# EasyEDA Pro project estop.eprj

# Schematic igvc_2324
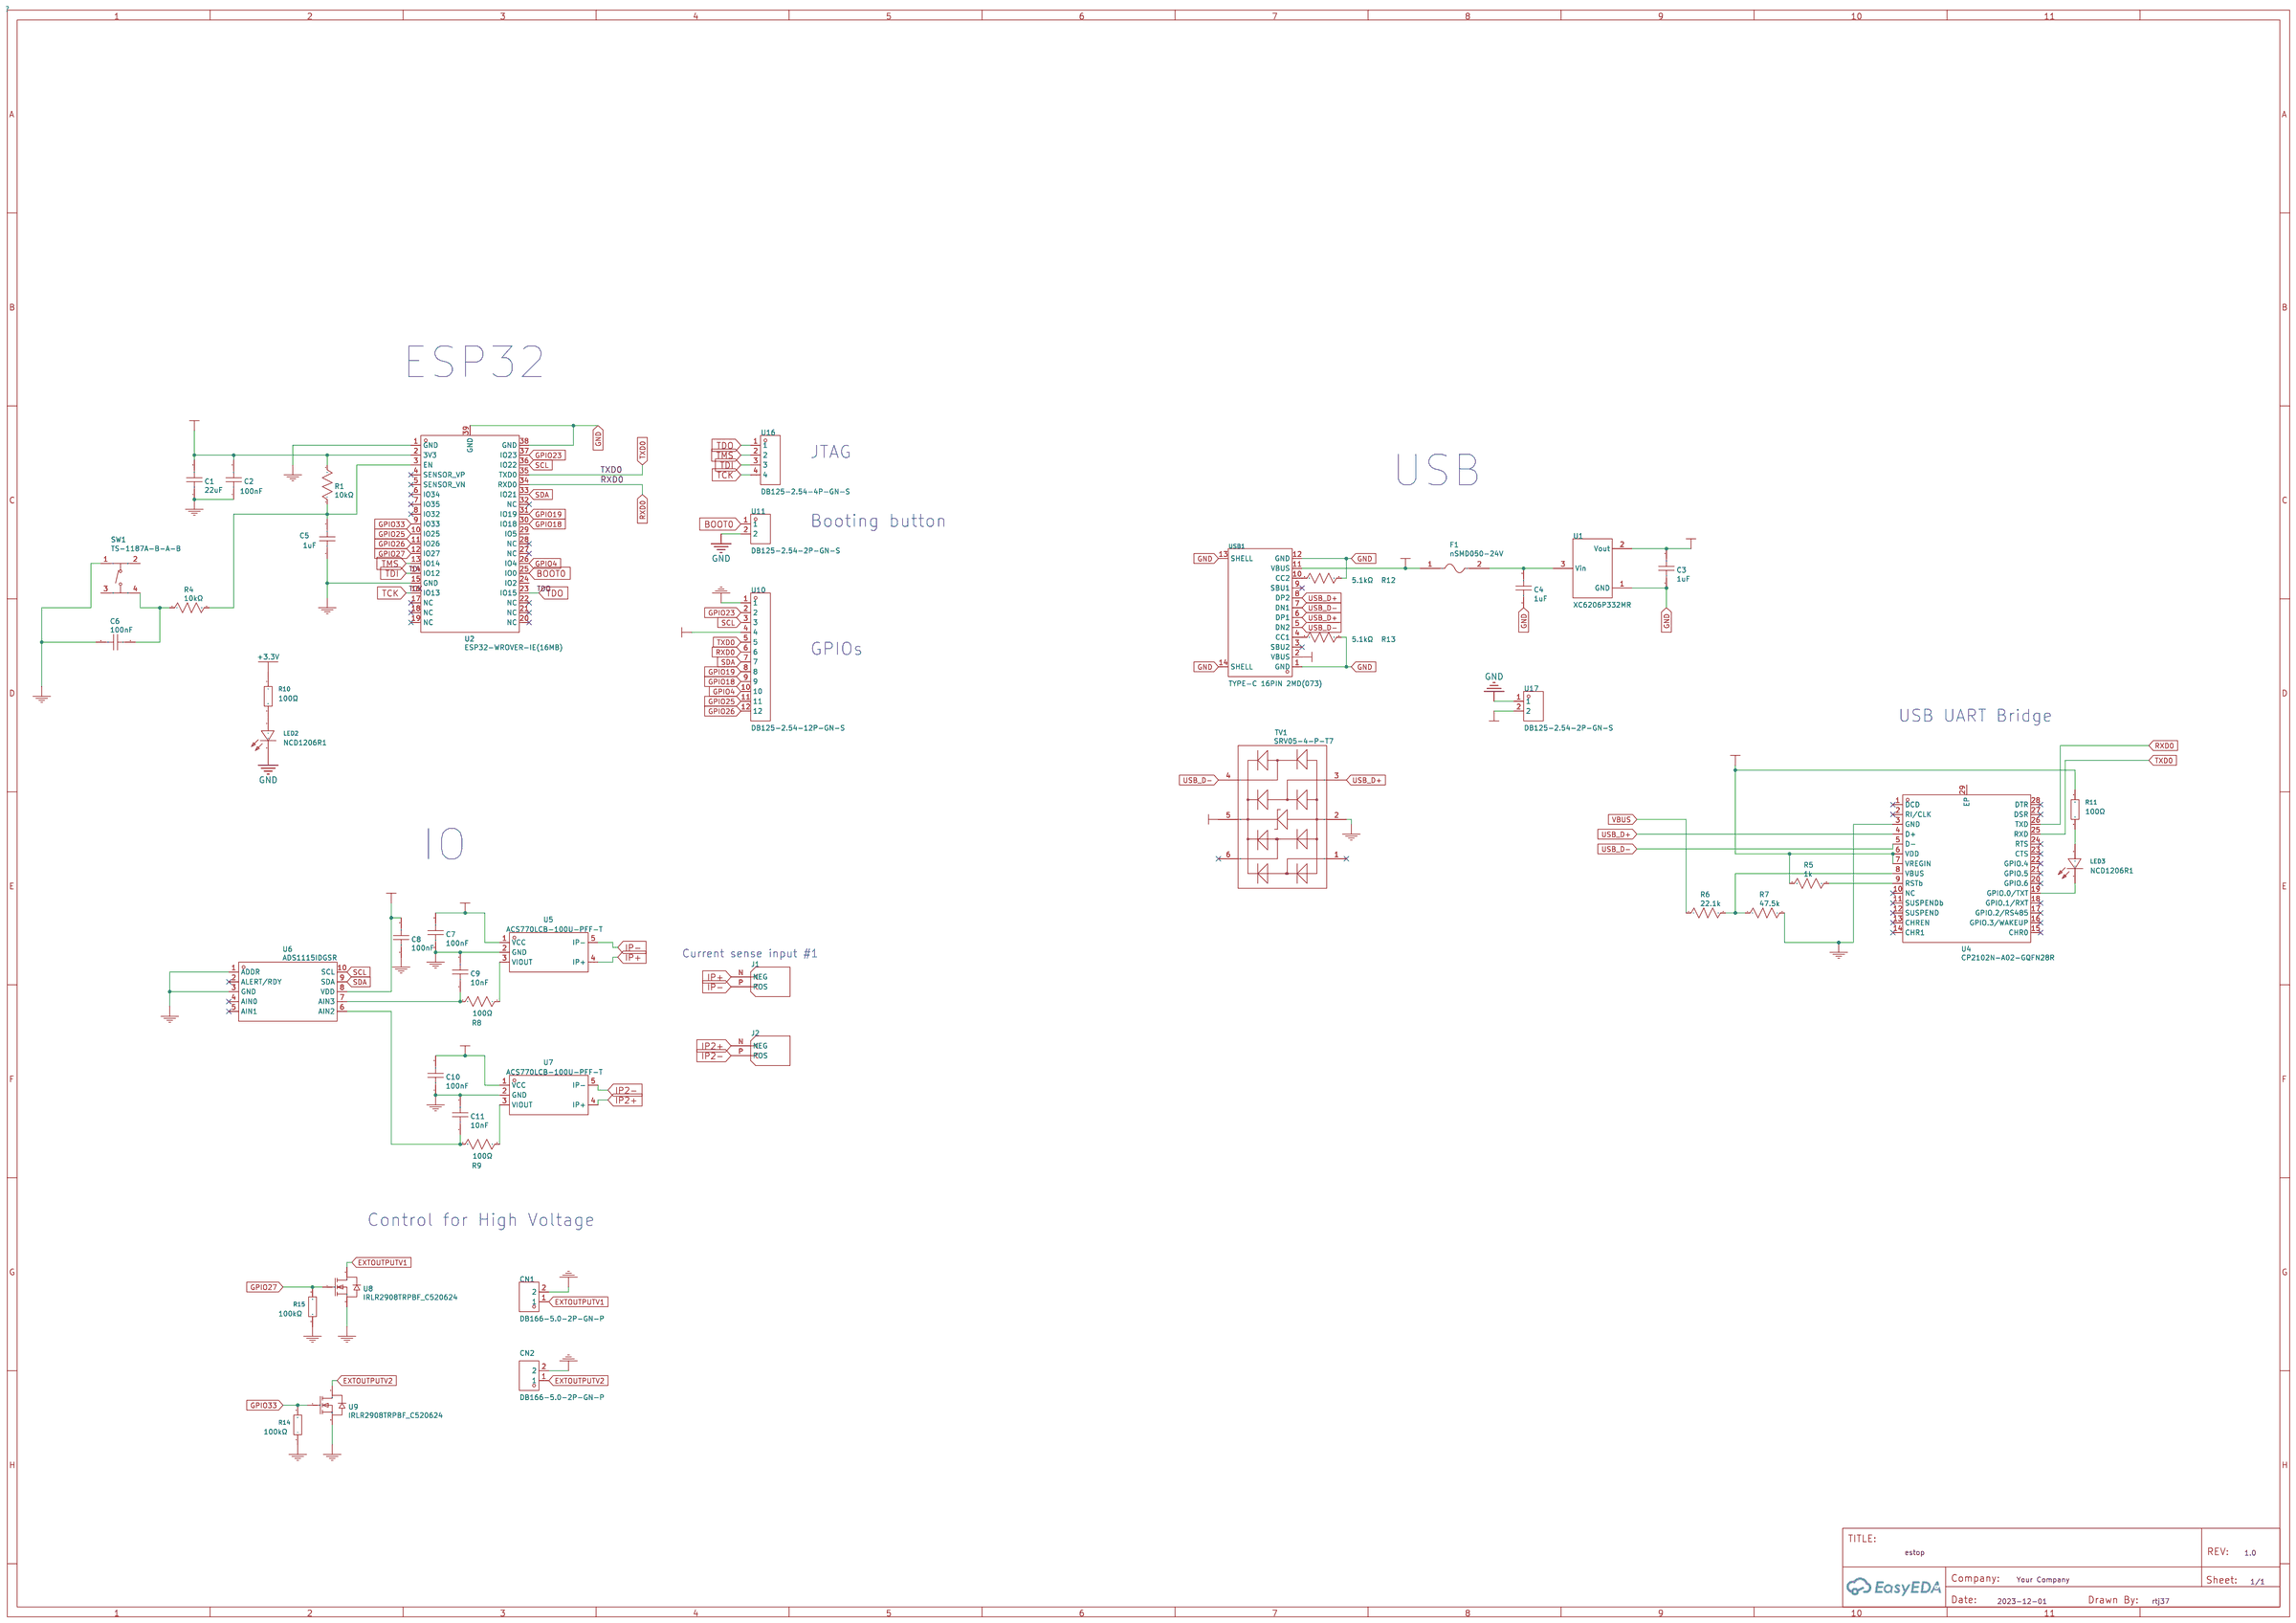
[diagram p0: schematic sheet]

## Parts
C1  22uF  [C1206]
C2  100nF  [C1206]
C3  1uF  [C1206]
C4  1uF  [C1206]
C5  1uF  [C1206]
C6  100nF  [C1206]
C7  100nF  [C1206]
C8  100nF  [C1206]
C9  10nF  [C1206]
C10  100nF  [C1206]
C11  10nF  [C1206]
CN1  DB166-5.0-2P-GN-P  [CONN-TH_2P-P5.00_DB166-5.0-2P-GN-P]
CN2  DB166-5.0-2P-GN-P  [CONN-TH_2P-P5.00_DB166-5.0-2P-GN-P]
F1  nSMD050-24V  [F1206]
J1  XT90PW-F  [AMASS_XT90PW-F]
J2  XT90PW-F  [AMASS_XT90PW-F]
LED2  NCD1206R1  [LED1206-R-RD_RED]
LED3  NCD1206R1  [LED1206-R-RD_RED]
R1  10kΩ  [R1206]
R4  10kΩ  [R1206]
R5  1k  [R1206]
R6  22.1k  [R1206]
R7  47.5k  [R1206]
R8  100Ω  [R1206]
R9  100Ω  [R1206]
R10  100Ω  [R1206]
R11  100Ω  [R1206]
R12  5.1kΩ  [R1206]
R13  5.1kΩ  [R1206]
R14  100kΩ  [R1206]
R15  100kΩ  [R1206]
SW1  TS-1187A-B-A-B  [SW-SMD_4P-L5.1-W5.1-P3.70-LS6.5-TL-2]
TV1  SRV05-4-P-T7  [SOT-23-6_L2.9-W1.6-P0.95-LS2.8-BR]
U1  XC6206P332MR  [SOT-23-3_L2.9-W1.6-P1.90-LS2.8-BR]
U2  ESP32-WROVER-IE(16MB)  [WIFI-SMD_ESP32-WROVER-E]
U4  CP2102N-A02-GQFN28R  [QFN-28_L5.0-W5.0-P0.50-TL-EP3.3]
U5  ACS770LCB-100U-PFF-T  [SENSOR-TH_ACS770LCB-100U-PFF-T]
U6  ADS1115IDGSR  [MSOP-10_L3.0-W3.0-P0.50-LS5.0-BL]
U7  ACS770LCB-100U-PFF-T  [SENSOR-TH_ACS770LCB-100U-PFF-T]
U8  IRLR2908TRPBF_C520624  [TO-252-3_L6.5-W6.1-P4.58-LS9.9-BR]
U9  IRLR2908TRPBF_C520624  [TO-252-3_L6.5-W6.1-P4.58-LS9.9-BR]
U10  DB125-2.54-12P-GN-S  [CONN-TH_DB125-2.54-12P-GN]
U11  DB125-2.54-2P-GN-S  [CONN-TH_DB125-2.54-2P-GN]
U16  DB125-2.54-4P-GN-S  [CONN-TH_DB125-2.54-4P-GN]
U17  DB125-2.54-2P-GN-S  [CONN-TH_DB125-2.54-2P-GN]
USB1  TYPE-C 16PIN 2MD(073)  [USB-C-SMD_TYPE-C-6PIN-2MD-073]

## Library data of the parts
C1 = CL31A226KAHNNNE: Capacitance: Tolerance:±10% Tolerance:±10% Voltage Rated: Temperature Coefficient:; LCSC Part Name: 22uF ±10% 25V; Supplier Part: C12891; Manufacturer: SAMSUNG(三星); Supplier Footprint: 1206; JLCPCB Part Class: Basic Part; Datasheet: https://atta.szlcsc.com/upload/public/pdf/source/20160218/1457707763339.pdf; Supplier: LCSC; Tolerance: ±10%; link: https://item.szlcsc.com/89171.html; 3DModel: C1206_L3.2-W1.6-H1.3
C2 C6 C8 = 1206B104K500NT: Capacitance:100nF Tolerance:±10% Tolerance:±10% Voltage Rated: Temperature Coefficient:; LCSC Part Name: 100nF ±10% 50V; Supplier Part: C110253; Manufacturer: FH(风华); Supplier Footprint: 1206; JLCPCB Part Class: Extended Part; Datasheet: https://atta.szlcsc.com/upload/public/pdf/source/20200305/C486355_26A10D38EF8C2A5C37091D0039909270.pdf; Supplier: LCSC; Tolerance: ±10%; link: https://item.szlcsc.com/89171.html; 3DModel: C1206_L3.2-W1.6-H1.3
C3 C4 = 1206B105K500NT_C90539: Capacitance:1uF Tolerance:±10% Tolerance:±10% Voltage Rated: Temperature Coefficient:; LCSC Part Name: 1uF ±10% 50V; Supplier Part: C90539; Manufacturer: FH(风华); Manufacturer Part: 1206B105K500NT; Supplier Footprint: 1206; JLCPCB Part Class: Extended Part; Datasheet: https://atta.szlcsc.com/upload/public/pdf/source/20200305/C486355_26A10D38EF8C2A5C37091D0039909270.pdf; Supplier: LCSC; Tolerance: ±10%; link: https://item.szlcsc.com/362304.html; 3DModel: C0603_L1.6-W0.8-H0.8
C5 = 1206B105K500NT_C90539: Capacitance:1uF Tolerance:±10% Tolerance:±10% Voltage Rated: Temperature Coefficient:; LCSC Part Name: 1uF ±10% 50V; Supplier Part: C90539; Manufacturer: FH(风华); Manufacturer Part: 1206B105K500NT; Supplier Footprint: 1206; JLCPCB Part Class: Extended Part; Datasheet: https://atta.szlcsc.com/upload/public/pdf/source/20200305/C486355_26A10D38EF8C2A5C37091D0039909270.pdf; Supplier: LCSC; Tolerance: ±10%; link: https://item.szlcsc.com/89171.html; 3DModel: C1206_L3.2-W1.6-H1.3
C7 C10 = 1206B104K500NT: Capacitance:100nF Tolerance:±10% Tolerance:±10% Voltage Rated: Temperature Coefficient:; LCSC Part Name: 100nF ±10% 50V; Supplier Part: C110253; Manufacturer: FH(风华); Supplier Footprint: 1206; JLCPCB Part Class: Extended Part; Datasheet: https://atta.szlcsc.com/upload/public/pdf/source/20200305/C486355_26A10D38EF8C2A5C37091D0039909270.pdf; Supplier: LCSC; Tolerance: ±10%; link: https://item.szlcsc.com/373011.html; 3DModel: C0805_L2.0-W1.3-H1.3
C9 C11 = 1206B103K102CT_C77498: Capacitance: Tolerance:±10% Tolerance:±10% Voltage Rated: Temperature Coefficient:; LCSC Part Name: 10nF ±10% 1kV; Supplier Part: C77498; Manufacturer: Walsin(华新科); Manufacturer Part: 1206B103K102CT; Supplier Footprint: 1206; JLCPCB Part Class: Extended Part; Supplier: LCSC; Tolerance: ±10%; link: https://item.szlcsc.com/373011.html; 3DModel: C0805_L2.0-W1.3-H1.3
CN1 CN2 = DB166-5.0-2P-GN-P: Pitch:5mm Number of Pins:2P; LCSC Part Name: 5mm; Supplier Part: C5162335; Manufacturer: DORABO(地博电气); Supplier Footprint: P=5mm; JLCPCB Part Class: Extended Part; Datasheet: https://atta.szlcsc.com/upload/public/pdf/source/20230321/B3942604DCE96DBD4C39B644F5671C5C.pdf; Supplier: LCSC; Pitch: 5mm; Number of Pins: 2P
F1 = nSMD050-24V: 3DModel: F1206_L3.2-W1.7-H0.6; link: https://lcsc.com/eda_search?q=C70076&amp;%26type=1&amp;ref=editor; Supplier: LCSC; Manufacturer: 台湾陆海; Supplier Part: C70076; JLCPCB Part Class: Extended Part
J1 J2 = XT90PW-F: \nSocket, DC supply, XT90, female, PIN:2, on PCBs, THT\n; MF: AMASS; MAXIMUM_PACKAGE_HEIGHT: 10.3 mm; Price: None; Check_prices: https://www.snapeda.com/parts/XT90PW-F/AMASS/view-part/?ref=eda; STANDARD: Manufacturer Recommendations; PARTREV: V00; SnapEDA_Link: https://www.snapeda.com/parts/XT90PW-F/AMASS/view-part/?ref=snap; Availability: Not in stock; MANUFACTURER: AMASS
LED2 LED3 = NCD1206R1_C84270: Emitted Color:Red Forward Voltage (VF):1.6V~2.6V Forward Voltage (VF):1.6V~2.6V Power Dissipation:65mW Forward Current:20mA Dominant Wavelength:615nm~630nm Dominant Wavelength:615nm~630nm Lens Color:无色透明透镜 Luminous Intensity:67mcd~195mcd Luminous Intensit; Supplier Part: C84270; Manufacturer: 国星光电; Supplier Footprint: 1206; JLCPCB Part Class: Extended Part; Datasheet: https://atta.szlcsc.com/upload/public/pdf/source/20200820/C84270_26D056BA53480CD9796A84C2EB45318C.pdf; Supplier: LCSC; Emitted Color: Red; Forward Voltage (VF): 1.6V~2.6V; Power Dissipation: 65mW; Forward Current: 20mA; Dominant Wavelength: 615nm~630nm; Lens Color: 无色透明透镜; Luminous Intensity: 67mcd~195mcd; Viewing Angle: 130°; Operating Temperature: -30℃~+85℃
R1 R4 = 1206W4F1002T5E: Type:Thick Film Resistors Resistance:10kΩ Tolerance:±1% Tolerance:±1% Power(Watts): Overload Voltage (Max): Temperature Coefficient:±100ppm/℃ Temperature Coefficient:±100ppm/℃ Operating Temperature Range:-55℃~+155℃ Operating Temperature Range:-55℃~+155℃; LCSC Part Name: 10kΩ ±1% 250mW 厚膜电阻; Supplier Part: C17902; Manufacturer: UNI-ROYAL(厚声); Supplier Footprint: 1206; JLCPCB Part Class: Basic Part; Datasheet: https://atta.szlcsc.com/upload/public/pdf/source/20200306/C422600_1E6D84923E4A46A82E41ADD87F860B5C.pdf; Supplier: LCSC; Type: Thick Film Resistors; Tolerance: ±1%; Temperature Coefficient: ±100ppm/℃; Operating Temperature Range: -55℃~+155℃; link: https://item.szlcsc.com/311874.html; 3DModel: R1206_L3.2-W1.6-H0.6
R5 = 1k: link: https://item.szlcsc.com/311874.html; 3DModel: R1206_L3.2-W1.6-H0.6; Supplier Part: C144508; Supplier: JLCPCB
R6 = 22.1k: link: https://item.szlcsc.com/311874.html; 3DModel: R1206_L3.2-W1.6-H0.6; Supplier Part: C2933645; Supplier: JLCPCB
R7 = 47.5k: link: https://item.szlcsc.com/311874.html; 3DModel: R1206_L3.2-W1.6-H0.6; Supplier Part: C3017055; Supplier: JLCPCB
R8 R9 = 1206W4F1000T5E_C17901: Type:Thick Film Resistors Resistance: Tolerance:±1% Tolerance:±1% Power(Watts): Overload Voltage (Max): Temperature Coefficient:±100ppm/℃ Temperature Coefficient:±100ppm/℃ Operating Temperature Range:-55℃~+155℃ Operating Temperature Range:-55℃~+155℃; LCSC Part Name: 100Ω ±1% 250mW 厚膜电阻; Supplier Part: C17901; Manufacturer: UNI-ROYAL(厚声); Manufacturer Part: 1206W4F1000T5E; Supplier Footprint: 1206; JLCPCB Part Class: Basic Part; Datasheet: https://atta.szlcsc.com/upload/public/pdf/source/20200306/C422600_1E6D84923E4A46A82E41ADD87F860B5C.pdf; Supplier: LCSC; Type: Thick Film Resistors; Tolerance: ±1%; Temperature Coefficient: ±100ppm/℃; Operating Temperature Range: -55℃~+155℃; 3DModel: R0603; link: https://www.mouser.in/datasheet/2/447/PYu_RT_1_to_0_01_RoHS_L_11-1669912.pdf
R10 R11 = 1206W4F1000T5E_C17901: Type:Thick Film Resistors Resistance: Tolerance:±1% Tolerance:±1% Power(Watts): Overload Voltage (Max): Temperature Coefficient:±100ppm/℃ Temperature Coefficient:±100ppm/℃ Operating Temperature Range:-55℃~+155℃ Operating Temperature Range:-55℃~+155℃; LCSC Part Name: 100Ω ±1% 250mW 厚膜电阻; Supplier Part: C17901; Manufacturer: UNI-ROYAL(厚声); Manufacturer Part: 1206W4F1000T5E; Supplier Footprint: 1206; JLCPCB Part Class: Basic Part; Datasheet: https://atta.szlcsc.com/upload/public/pdf/source/20200306/C422600_1E6D84923E4A46A82E41ADD87F860B5C.pdf; Supplier: LCSC; Type: Thick Film Resistors; Tolerance: ±1%; Temperature Coefficient: ±100ppm/℃; Operating Temperature Range: -55℃~+155℃
R12 R13 = 1206W4F5101T5E: Type:Thick Film Resistors Resistance:5.1kΩ Tolerance:±1% Tolerance:±1% Power(Watts): Overload Voltage (Max): Temperature Coefficient:±100ppm/℃ Temperature Coefficient:±100ppm/℃ Operating Temperature Range:-55℃~+155℃ Operating Temperature Range:-55℃~+155℃; LCSC Part Name: 5.1kΩ ±1% 250mW 厚膜电阻; Supplier Part: C26033; Manufacturer: UNI-ROYAL(厚声); Supplier Footprint: 1206; JLCPCB Part Class: Extended Part; Datasheet: https://atta.szlcsc.com/upload/public/pdf/source/20200306/C422600_1E6D84923E4A46A82E41ADD87F860B5C.pdf; Supplier: LCSC; Type: Thick Film Resistors; Tolerance: ±1%; Temperature Coefficient: ±100ppm/℃; Operating Temperature Range: -55℃~+155℃; 3DModel: R0603; link: https://www.mouser.in/datasheet/2/447/PYu_RT_1_to_0_01_RoHS_L_11-1669912.pdf
R14 R15 = 1206W4F1003T5E: Type:Thick Film Resistors Resistance:100kΩ Tolerance:±1% Tolerance:±1% Power(Watts): Overload Voltage (Max): Temperature Coefficient:±100ppm/℃ Temperature Coefficient:±100ppm/℃ Operating Temperature Range:-55℃~+155℃ Operating Temperature Range:-55℃~+155℃; LCSC Part Name: 100kΩ ±1% 250mW 厚膜电阻; Supplier Part: C17900; Manufacturer: UNI-ROYAL(厚声); Supplier Footprint: 1206; JLCPCB Part Class: Basic Part; Datasheet: https://atta.szlcsc.com/upload/public/pdf/source/20200306/C422600_1E6D84923E4A46A82E41ADD87F860B5C.pdf; Supplier: LCSC; Type: Thick Film Resistors; Tolerance: ±1%; Temperature Coefficient: ±100ppm/℃; Operating Temperature Range: -55℃~+155℃
SW1 = TS-1187A-B-A-B: link: https://lcsc.com/eda_search?q=C318884&amp;%26type=1&amp;ref=editor; 3DModel: SW-SMD_4P-L5.2-W5.2-H1.5-LS6.4-P3.70; Supplier: LCSC; Supplier Part: C318884; Manufacturer: XKB Connectivity(中国星坤); JLCPCB Part Class: Basic Part
TV1 = SRV05-4-P-T7: link: https://lcsc.com/eda_search?q=C85364&amp;%26type=1&amp;ref=editor; 3DModel: SOT-23-6_L2.9-W1.6-H1.5-LS2.8-P0.95; Supplier: LCSC; Manufacturer: PROTEK; Supplier Part: C85364; JLCPCB Part Class: Basic Part
U1 = XC6206P332MR: link: https://lcsc.com/eda_search?q=C5446&amp;%26type=1&amp;ref=editor; 3DModel: SOT-23-3L_L2.9-W1.6-H1.1-LS2.8-P0.95; Supplier: LCSC; Manufacturer: TOREX(特瑞仕); Supplier Part: C5446; JLCPCB Part Class: Basic Part
U2 = ESP32-WROVER-IE(16MB): link: https://lcsc.com/eda_search?q=C701352&amp;%26type=1&amp;ref=editor; 3DModel: WIFI-SMD_L31.4-W18.0-H3.3-ESP32-WROVER-E; Supplier: LCSC; Supplier Part: C701352; Manufacturer: ESPRESSIF(乐鑫); Manufacturer Part: ESP32-WROVER-IE-N16R8; JLCPCB Part Class: Extended Part
U4 = CP2102N-A02-GQFN28R: link: https://lcsc.com/eda_search?q=C964632&amp;%26type=1&amp;ref=editor; 3DModel: QFN-28_L5.0-W5.0-H0.9-P0.50; Supplier: LCSC; Supplier Part: C964632; Manufacturer: SILICON LABS(芯科); JLCPCB Part Class: Extended Part
U5 U7 = ACS770LCB-100U-PFF-T: link: https://lcsc.com/eda_search?q=C163295&amp;%26type=1&amp;ref=editor; 3DModel: SENSOR-TH_L10.0-W13.0-H7.0-ACS770LCB-100U-PFF-T; Supplier: LCSC; Manufacturer: ALLEGRO(美国埃戈罗); Supplier Part: C163295; JLCPCB Part Class: Extended Part
U6 = ADS1115IDGSR: link: https://lcsc.com/eda_search?q=C37593&amp;%26type=1&amp;ref=editor; 3DModel: MSOP-10_L3.0-W3.0-H1.1-LS5.0-P0.50; Supplier: LCSC; Manufacturer: TI(德州仪器); Supplier Part: C37593; JLCPCB Part Class: Extended Part
U8 U9 = IRLR2908TRPBF_C520624: link: https://lcsc.com/eda_search?q=C520624&amp;%26type=1&amp;ref=editor; Supplier: LCSC; Supplier Part: C520624; Manufacturer: Infineon(英飞凌); Manufacturer Part: IRLR2908TRPBF; JLCPCB Part Class: Extended Part
U10 = DB125-2.54-12P-GN-S: Structure:1x12P Pitch:2.54mm Color:Green Mounting Style:Straight Current Rating (Max):8A Voltage Rating (Max):130V Number of Pins:12P Number of Rows:1 Wire Gauge - AWG:18~26 Wire Gauge - AWG:18~26 Wire Gauge - mm2:0.5~1 Wire Gauge - mm2:0.5~1 Number of PI; LCSC Part Name: 2.54mm 1x12P 排数:1 每排P数:12 直插; Supplier Part: C918129; Manufacturer: DORABO(地博电气); Supplier Footprint: 插件,P=2.54mm; JLCPCB Part Class: Extended Part; Datasheet: https://atta.szlcsc.com/upload/public/pdf/source/20230106/BCD3A0BE1EB95DC3E813F1745F022035.pdf; Supplier: LCSC; Structure: 1x12P; Pitch: 2.54mm; Color: Green; Mounting Style: Straight; Current Rating (Max): 8A; Voltage Rating (Max): 130V; Number of Pins: 12P; Number of Rows: 1; Wire Gauge - AWG: 18~26; Wire Gauge - mm2: 0.5~1; Number of PINs Per Row: 12; Operating Temperature Range: -40℃~+105℃
U11 U17 = DB125-2.54-2P-GN-S: Structure:1x2P Pitch:2.54mm Color:Green Mounting Style:Straight Current Rating (Max):8A Voltage Rating (Max):130V Number of Pins:2P Number of Rows:1 Wire Gauge - AWG:18~26 Wire Gauge - AWG:18~26 Wire Gauge - mm2:0.5~1 Wire Gauge - mm2:0.5~1 Number of PINs; LCSC Part Name: 2.54mm 1x2P 排数:1 每排P数:2 直插; Supplier Part: C918120; Manufacturer: DORABO(地博电气); Supplier Footprint: 插件,P=2.54mm; JLCPCB Part Class: Extended Part; Datasheet: https://atta.szlcsc.com/upload/public/pdf/source/20230106/BCD3A0BE1EB95DC3E813F1745F022035.pdf; Supplier: LCSC; Structure: 1x2P; Pitch: 2.54mm; Color: Green; Mounting Style: Straight; Current Rating (Max): 8A; Voltage Rating (Max): 130V; Number of Pins: 2P; Number of Rows: 1; Wire Gauge - AWG: 18~26; Wire Gauge - mm2: 0.5~1; Number of PINs Per Row: 2; Operating Temperature Range: -40℃~+105℃
U16 = DB125-2.54-4P-GN-S: Structure:1x4P Pitch:2.54mm Color:Green Mounting Style:Straight Current Rating (Max):8A Voltage Rating (Max):130V Number of Pins:4P Number of Rows:1 Wire Gauge - AWG:18~26 Wire Gauge - AWG:18~26 Wire Gauge - mm2:0.5~1 Wire Gauge - mm2:0.5~1 Number of PINs; LCSC Part Name: 2.54mm 1x4P 排数:1 每排P数:4 直插; Supplier Part: C918122; Manufacturer: DORABO(地博电气); Supplier Footprint: 插件,P=2.54mm; JLCPCB Part Class: Extended Part; Datasheet: https://atta.szlcsc.com/upload/public/pdf/source/20230106/BCD3A0BE1EB95DC3E813F1745F022035.pdf; Supplier: LCSC; Structure: 1x4P; Pitch: 2.54mm; Color: Green; Mounting Style: Straight; Current Rating (Max): 8A; Voltage Rating (Max): 130V; Number of Pins: 4P; Number of Rows: 1; Wire Gauge - AWG: 18~26; Wire Gauge - mm2: 0.5~1; Number of PINs Per Row: 4; Operating Temperature Range: -40℃~+105℃
USB1 = TYPE-C 16PIN 2MD(073): Connector Type:Type-C Standard:- Gender:Female Number of Ports:1 Number of Contacts:16P Mounting Style:卧贴 Current Rating - Power (Max):5A Operating Temperature Range:-25℃~+85℃ Operating Temperature Range:-25℃~+85℃; LCSC Part Name: Type-C 母 卧贴; Supplier Part: C2765186; Manufacturer: SHOU HAN(首韩); Supplier Footprint: SMD; JLCPCB Part Class: Extended Part; Datasheet: https://atta.szlcsc.com/upload/public/pdf/source/20211123/39B17C16241EAC15C5E277BDA434118E.pdf; Supplier: LCSC; Connector Type: Type-C; Gender: Female; Number of Ports: 1; Number of Contacts: 16P; Mounting Style: 卧贴; Current Rating - Power (Max): 5A; Operating Temperature Range: -25℃~+85℃

## Nets
+3.3V: C1.2 C2.2 C3.2 C8.2 R1.2 R5.1 R10.1 R11.1 U1.2(Vout) U2.2(3V3) U4.6(VDD) U4.7(VREGIN) U6.8(VDD) U10.4
GND: C1.1 C2.1 C3.1 C4.1 C5.1 C6.1 C7.1 C8.1 C9.2 C10.1 C11.2 CN1.2 CN2.2 LED2.2(K) R7.2 R12.2 R13.2 R14.1 R15.1 SW1.1(A) TV1.2 U1.1(GND) U2.1(GND) U2.15(GND) U2.38(GND) U2.39(GND) U4.3(GND) U5.2(GND) U6.1(ADDR) U6.3(GND) U7.2(GND) U8.3(S) U9.3(S) U10.1 U11.2 U17.1 USB1.1(GND) USB1.12(GND) USB1.13(SHELL) USB1.14(SHELL)
VBUS: C7.2 C10.2 F1.1 R6.1 TV1.5 U5.1(VCC) U7.1(VCC) U17.2 USB1.2(VBUS) USB1.11(VBUS)
BOOT0: U2.25(IO0) U11.1
EXTOUTPUTV1: CN1.1 U8.2(D)
EXTOUTPUTV2: CN2.1 U9.2(D)
GPIO4: U2.26(IO4) U10.10
GPIO18: U2.30(IO18) U10.9
GPIO19: U2.31(IO19) U10.8
GPIO23: U2.37(IO23) U10.2
GPIO25: U2.10(IO25) U10.11
GPIO26: U2.11(IO26) U10.12
GPIO27: R15.2 U2.12(IO27) U8.1(G)
GPIO33: R14.2 U2.9(IO33) U9.1(G)
IP2+: J2.N(NEG) U7.4(IP+)
IP2-: J2.P(POS) U7.5(IP-)
IP+: J1.N(NEG) U5.4(IP+)
IP-: J1.P(POS) U5.5(IP-)
RXD0: U2.34(RXD0) U4.26(TXD) U10.6
SCL: U2.36(IO22) U6.10(SCL) U10.3
SDA: U2.33(IO21) U6.9(SDA) U10.7
TCK: U2.16(IO13) U16.4
TDI: U2.14(IO12) U16.3
TDO: U2.23(IO15) U16.1
TMS: U2.13(IO14) U16.2
TXD0: U2.35(TXD0) U4.25(RXD) U10.5
USB_D+: TV1.3 U4.4(D+) USB1.6(DP1) USB1.8(DP2)
USB_D-: TV1.4 U4.5(D-) USB1.5(DN2) USB1.7(DN1)
$1N2: C6.2 R4.1 SW1.4(D)
$1N3: C5.2 R1.1 R4.2 U2.3(EN)
$1N21: C4.2 F1.2 U1.3(Vin)
$1N27: LED3.1(A) R11.2
$1N28: LED3.2(K) U4.19(GPIO.0/TXT)
$1N32: R6.2 R7.1 U4.8(VBUS)
$1N37: R5.2 U4.9(RSTb)
$1N45: C11.1 R9.2 U6.6(AIN2)
$1N46: R9.1 U7.3(VIOUT)
$1N48: C9.1 R8.2 U6.7(AIN3)
$1N49: R8.1 U5.3(VIOUT)
$1N11253: LED2.1(A) R10.2
$1N11937: R12.1 USB1.10(CC2)
$1N11979: R13.1 USB1.4(CC1)

Not connected (* = marked no-connect by the designer): SW1 2(B) 3(C); TV1 1* 6*; U2 4(SENSOR_VP)* 5(SENSOR_VN)* 6(IO34)* 7(IO35)* 8(IO32)* 17(NC)* 18(NC)* 19(NC)* 20(NC)* 21(NC)* 22(NC)* 24(IO2) 27(NC)* 28(NC)* 29(IO5) 32(NC)*; U4 1(DCD)* 2(RI/CLK)* 10(NC)* 11(SUSPENDb)* 12(SUSPEND)* 13(CHREN)* 14(CHR1)* 15(CHR0)* 16(GPIO.3/WAKEUP)* 17(GPIO.2/RS485)* 18(GPIO.1/RXT)* 20(GPIO.6)* 21(GPIO.5)* 22(GPIO.4)* 23(CTS)* 24(RTS)* 27(DSR)* 28(DTR)* 29(EP); U6 2(ALERT/RDY)* 4(AIN0)* 5(AIN1)*; USB1 3(SBU2)* 9(SBU1)*

## Notes on the sheet
- ESP32
- JTAG
- USB
- Booting button
- GPIOs
- USB UART Bridge
- IO
- Current sense input #1
- Control for High Voltage

# Board 1-PCB_PCB_igvc_2324
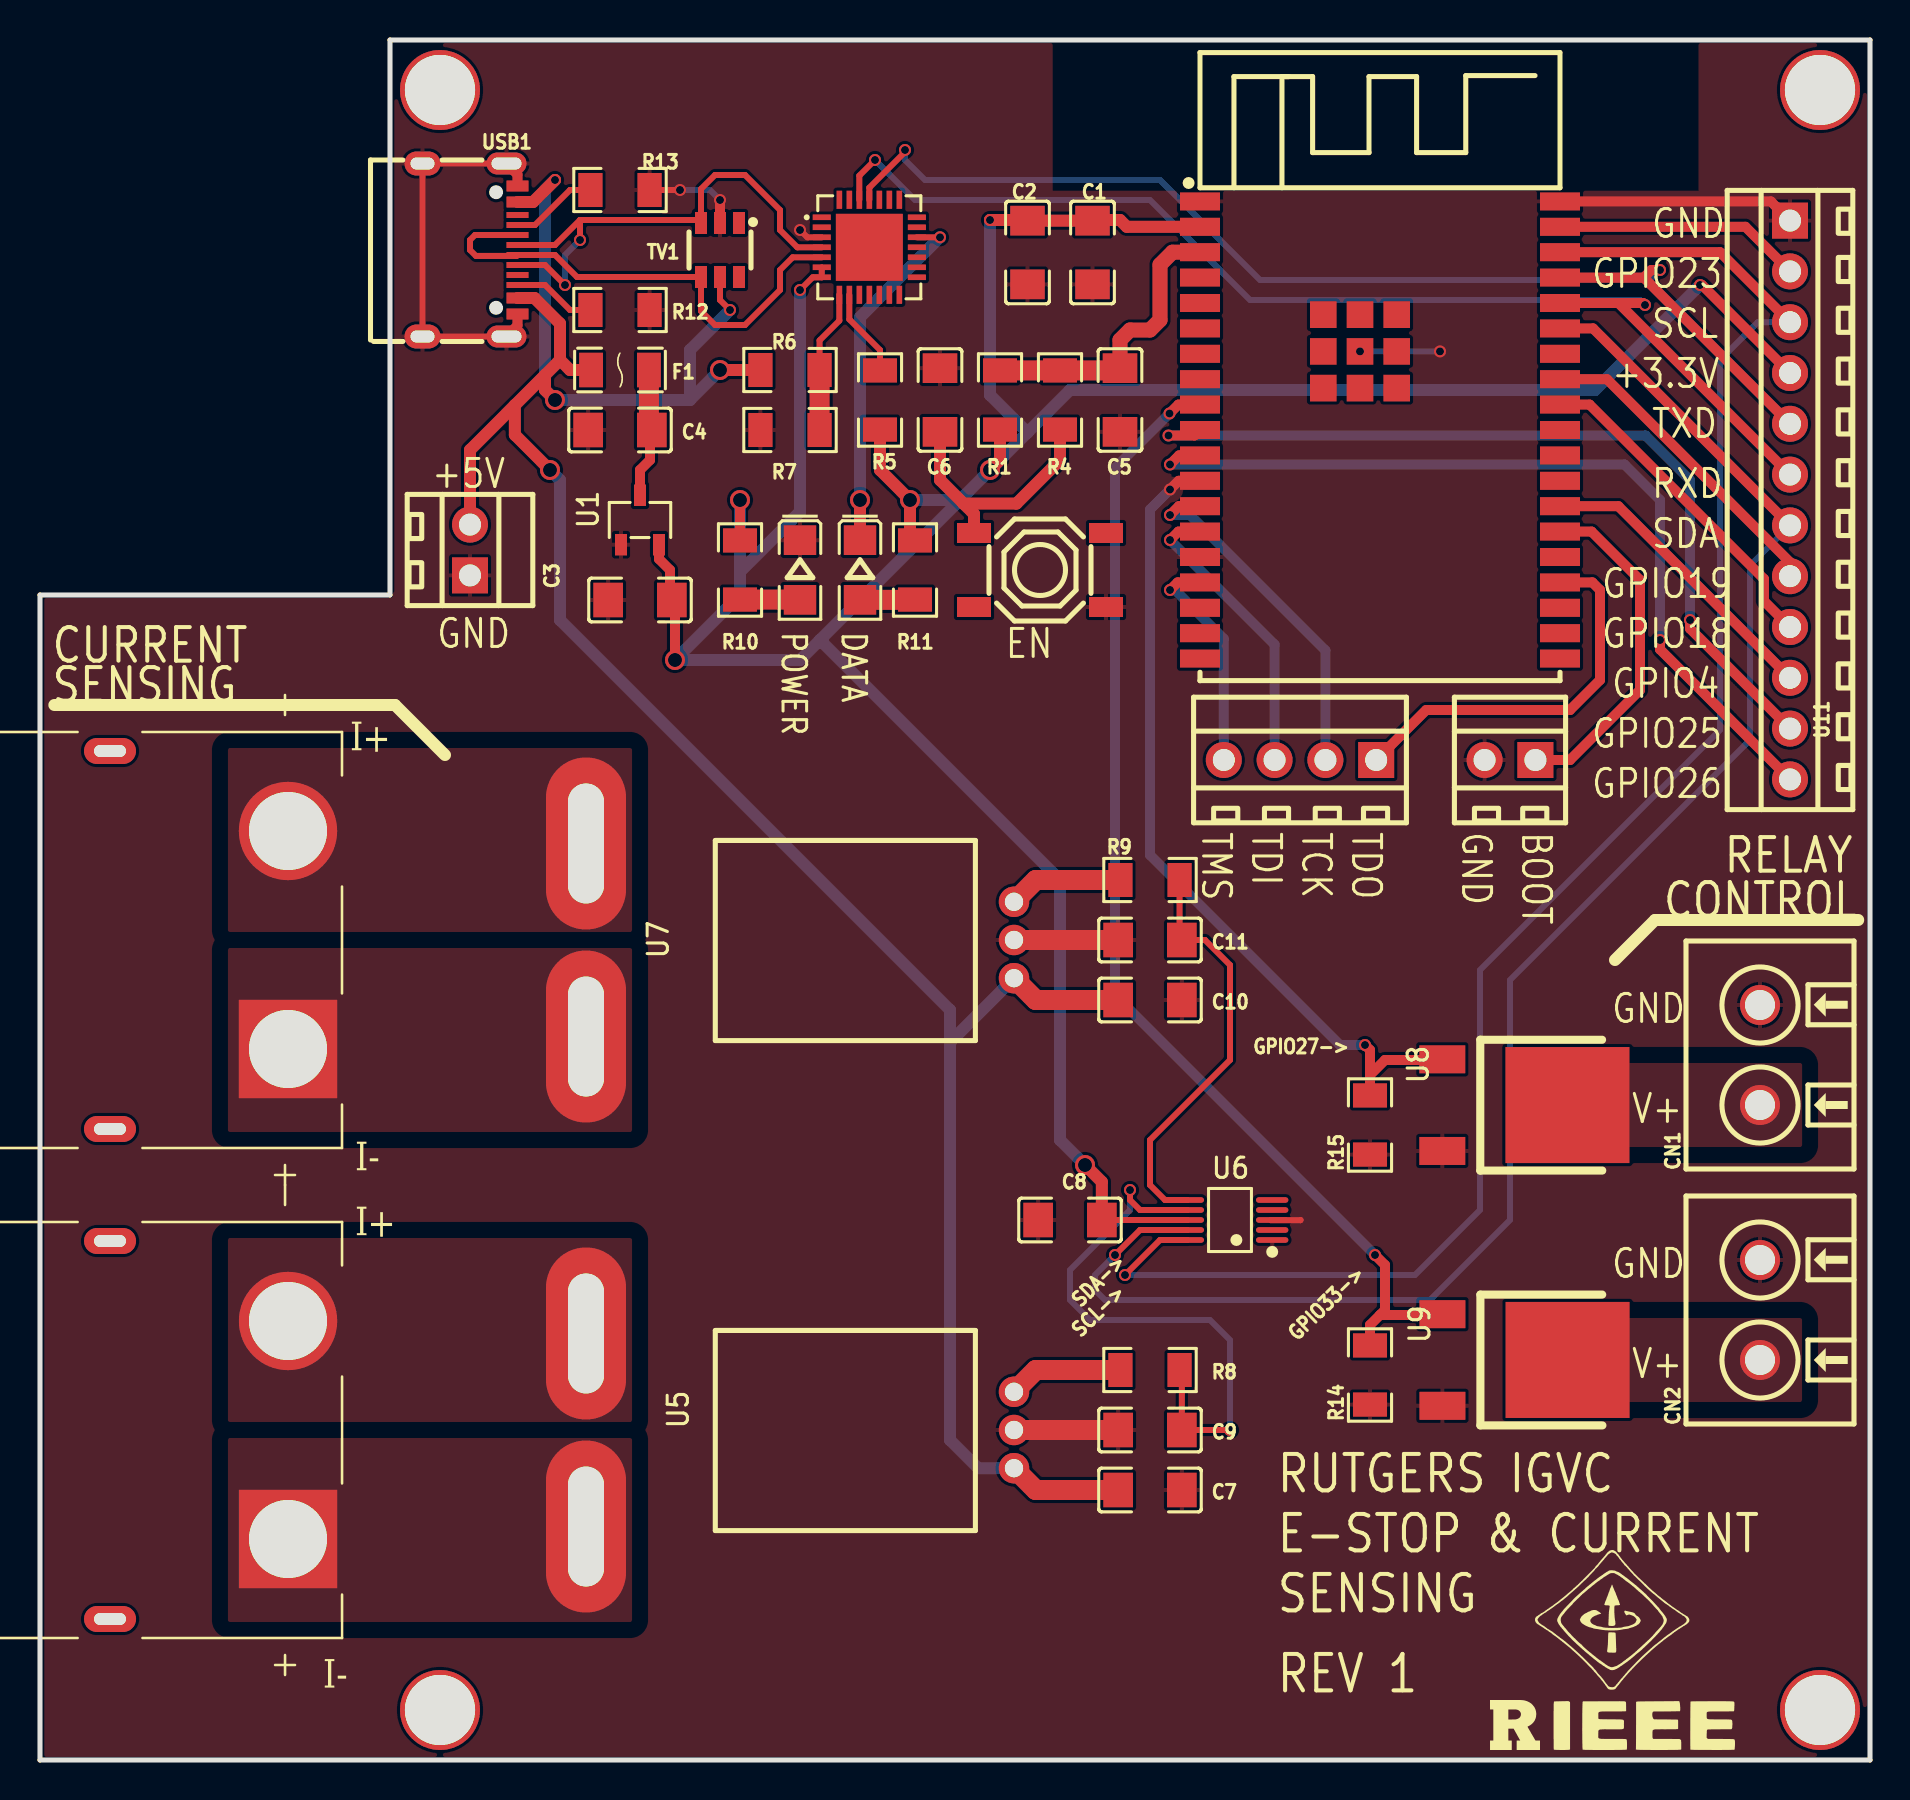
[diagram p1: board, top side]
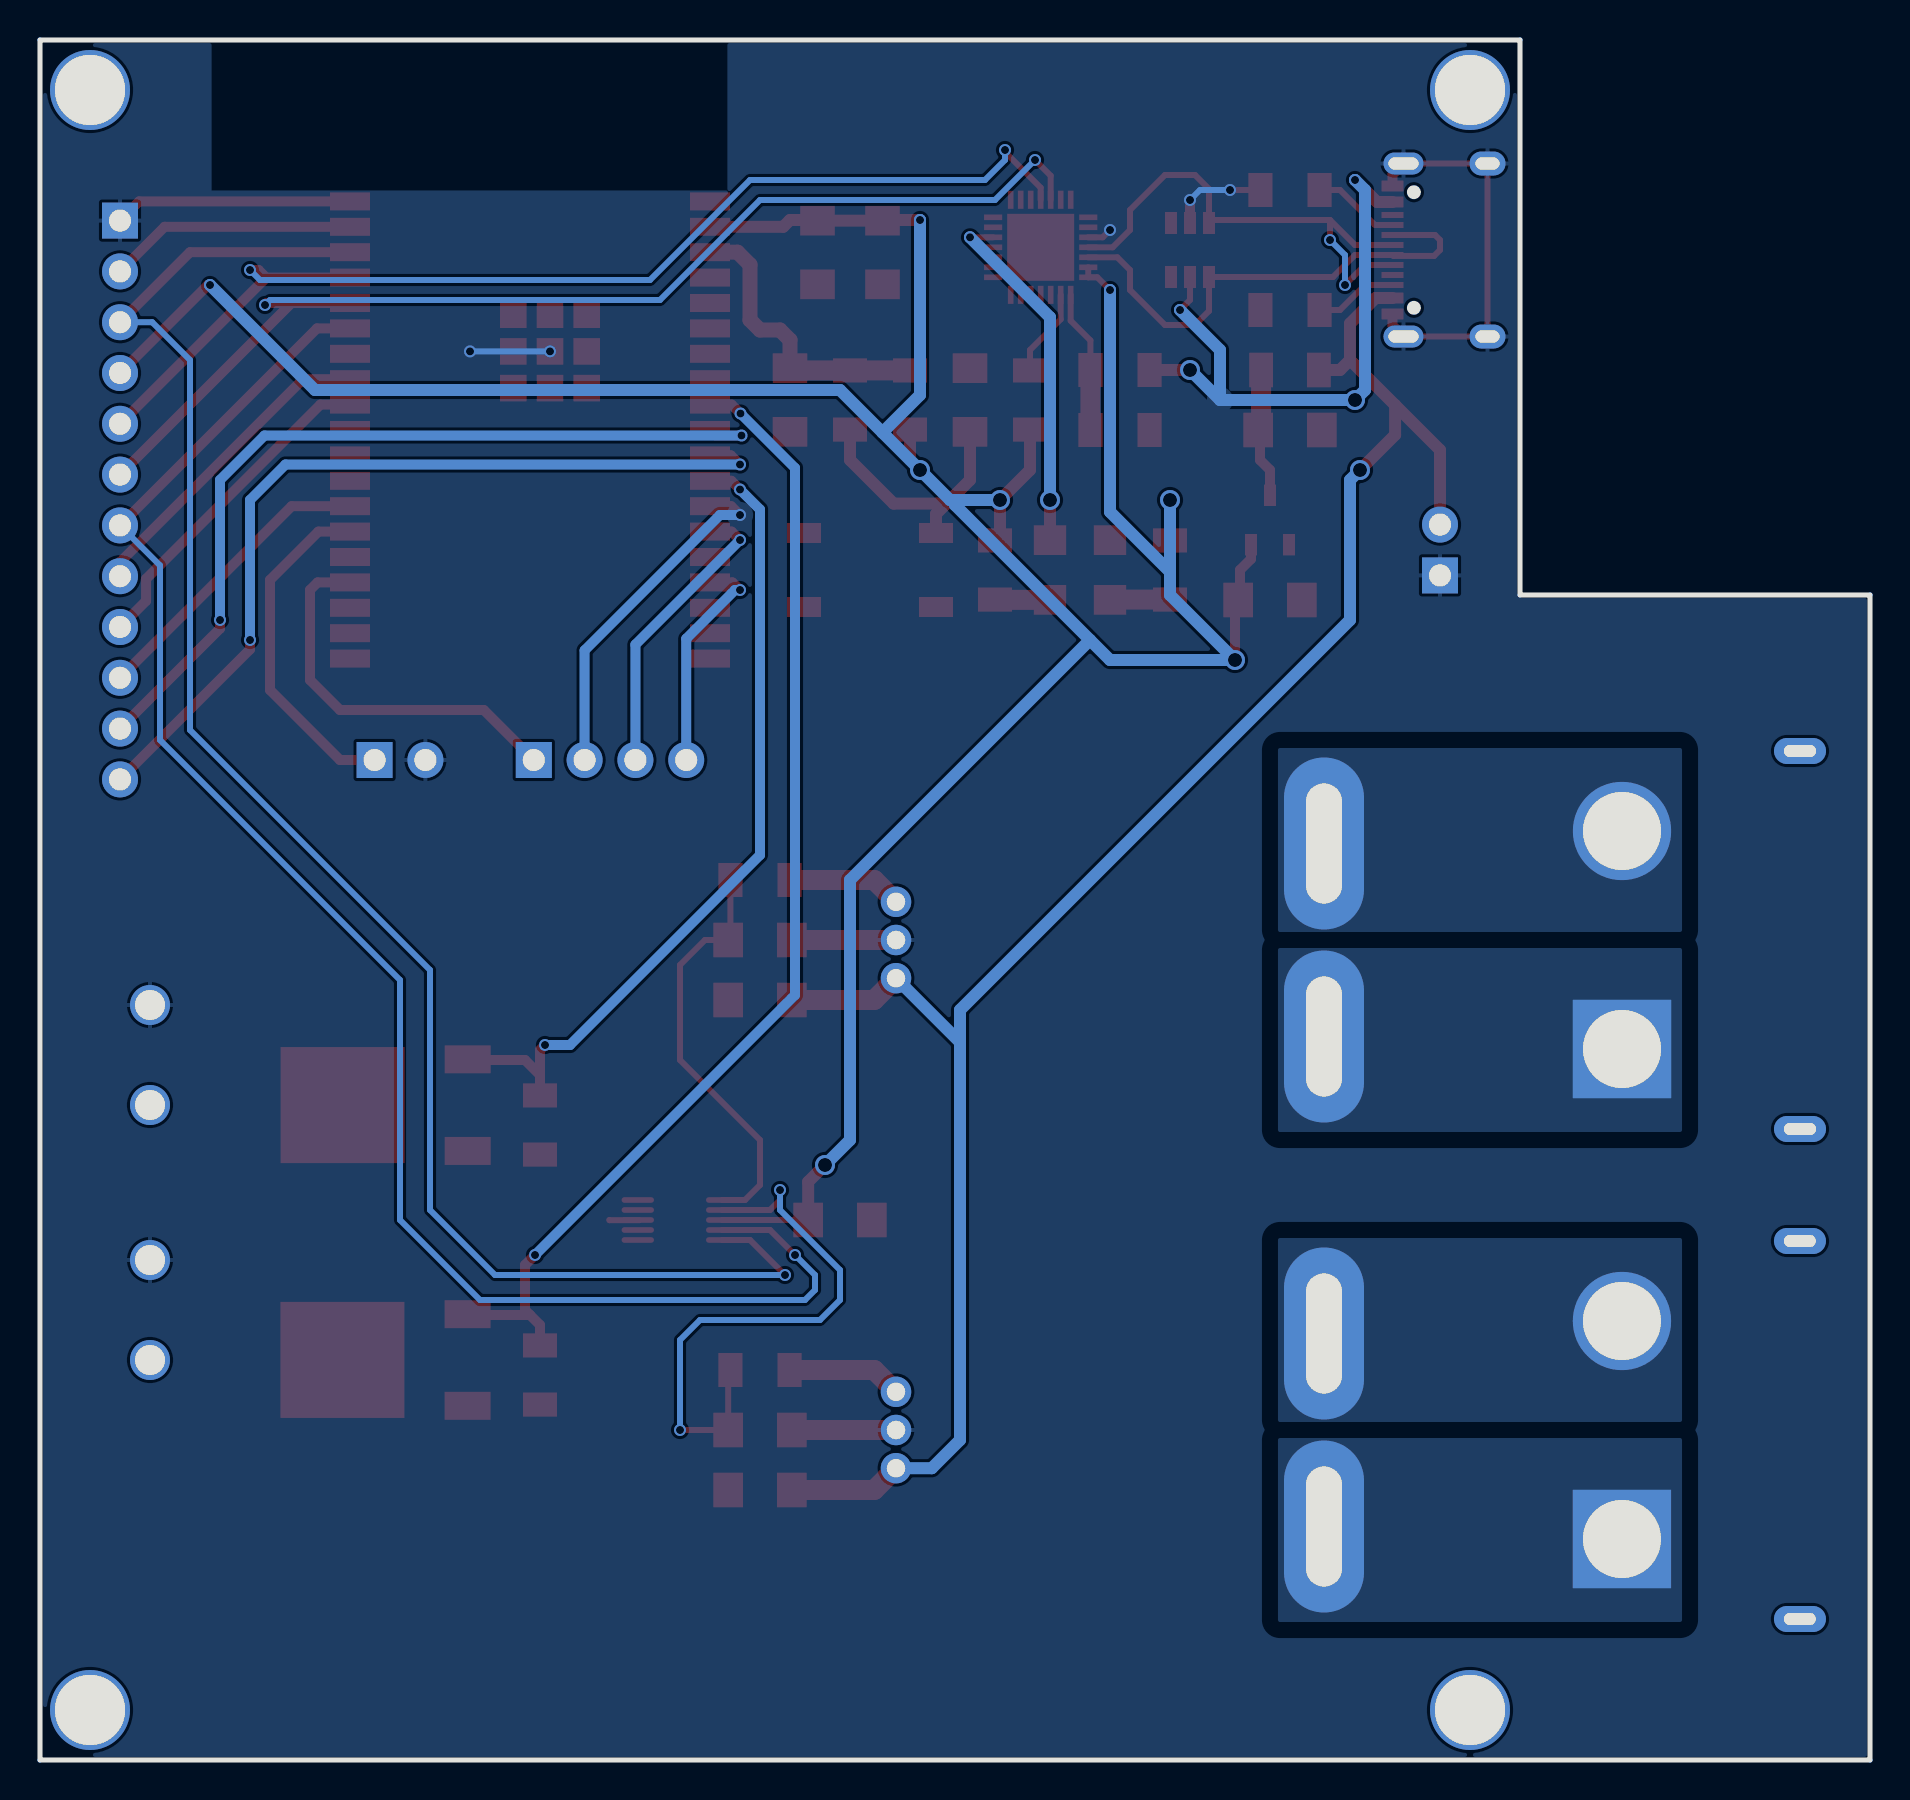
[diagram p2: board, bottom side, seen from below]

Outline 91.5 x 86 mm; copper layers: Top Layer, Bottom Layer. Coordinates in mm from the lower left corner of the outline.
Outline path: 0,58.25 17.5,58.25 17.5,86 91.5,86 91.5,0 0,0 0,58.25
Stack: Top Layer 0.035mm - / Dielectric1 1.51mm FR4 er 4.5 / Bottom Layer 0.035mm -

## Design rules (mm)
template: Custom Config
spacing copperThickness1oz (default): track to track 0.102, other pairs 0.152 to 0.3
spacing copperThickness2oz: track to track 0.203, other pairs 0.152 to 0.3
track width copperThickness1oz (default): min 0.127, default 0.254, max 2.54
track width copperThickness2oz: min 0.203, default 0.254, max 2.54
differential pair differentialPair (default): width min 0.127, default 0.254, max 2.54; gap min 0.152, default 0.152
via viaSize (default): diameter min 0.5, default 0.61, max 10; hole min 0.3, default 0.305, max 6.3
net IP2+ uses highamp
net IP2- uses highamp
net IP+ uses highamp
net IP- uses highamp
pour e128 uses highamp
pour e126 uses highamp
pour e586 uses highamp

## Placement (name value [footprint] x y rotation side)
C1  22uF  [C1206]  52.62 75.38 90 top
C2  100nF  [C1206]  49.38 75.38 90 top
C3  1uF  [C1206]  30 58 0 top
C4  1uF  [C1206]  29 66.5 0 top
C5  1uF  [C1206]  54 68 90 top
C6  100nF  [C1206]  45 68 270 top
C7  100nF  [C1206]  55.5 13.5 180 top
C8  100nF  [C1206]  51.5 27 0 top
C9  10nF  [C1206]  55.5 16.5 180 top
C10  100nF  [C1206]  55.5 38 180 top
C11  10nF  [C1206]  55.5 41 180 top
CN1  DB166-5.0-2P-GN-P  [CONN-TH_2P-P5.00_DB166-5.0-2P-GN-P]  86 35.25 90 top
CN2  DB166-5.0-2P-GN-P  [CONN-TH_2P-P5.00_DB166-5.0-2P-GN-P]  86 22.5 90 top
F1  nSMD050-24V  [F1206]  29 69.5 0 top
J1  XT90PW-F  [AMASS_XT90PW-F]  3.5 16.5 270 top
J2  XT90PW-F  [AMASS_XT90PW-F]  3.5 41 270 top
LED2  NCD1206R1  [LED1206-R-RD_RED]  38 59.5 270 top
LED3  NCD1206R1  [LED1206-R-RD_RED]  41 59.5 270 top
NOREF  -  [Pad_e136]  89 2.5 0 top
NOREF#2  -  [Pad_e132]  20 2.5 0 top
NOREF#3  -  [Pad_e137]  89 83.5 0 top
NOREF#4  -  [Pad_e135]  20 83.5 0 top
R1  10kΩ  [R1206]  48 68 270 top
R4  10kΩ  [R1206]  51 68 90 top
R5  1k  [R1206]  42 68 90 top
R6  22.1k  [R1206]  37.5 69.5 0 top
R7  47.5k  [R1206]  37.5 66.5 180 top
R8  100Ω  [R1206]  55.5 19.5 0 top
R9  100Ω  [R1206]  55.5 44 0 top
R10  100Ω  [R1206]  35 59.5 270 top
R11  100Ω  [R1206]  43.75 59.5 270 top
R12  5.1kΩ  [R1206]  29 72.5 0 top
R13  5.1kΩ  [R1206]  29 78.5 0 top
R14  100kΩ  [R1206]  66.5 19.25 90 top
R15  100kΩ  [R1206]  66.5 31.75 90 top
SW1  TS-1187A-B-A-B  [SW-SMD_4P-L5.1-W5.1-P3.70-LS6.5-TL-2]  50 59.5 180 top
TV1  SRV05-4-P-T7  [SOT-23-6_L2.9-W1.6-P0.95-LS2.8-BR]  34 75.5 90 top
U1  XC6206P332MR  [SOT-23-3_L2.9-W1.6-P1.90-LS2.8-BR]  30 62 270 top
U2  ESP32-WROVER-IE(16MB)  [WIFI-SMD_ESP32-WROVER-E]  67 66.5 0 top
U4  CP2102N-A02-GQFN28R  [QFN-28_L5.0-W5.0-P0.50-TL-EP3.3]  41.47 75.64 0 top
U5  ACS770LCB-100U-PFF-T  [SENSOR-TH_ACS770LCB-100U-PFF-T]  38 16.5 90 top
U6  ADS1115IDGSR  [MSOP-10_L3.0-W3.0-P0.50-LS5.0-BL]  59.5 27 90 top
U7  ACS770LCB-100U-PFF-T  [sensor-th_acs770lcb-100u-pff-t]  38 41 90 top
U8  IRLR2908TRPBF_C520624  [TO-252-3_L6.5-W6.1-P4.58-LS9.9-BR]  73.24 32.74 180 top
U9  IRLR2908TRPBF_C520624  [TO-252-3_L6.5-W6.1-P4.58-LS9.9-BR]  73.25 20 180 top
U10  DB125-2.54-12P-GN-S  [CONN-TH_DB125-2.54-12P-GN]  87.5 63 270 top
U11  DB125-2.54-2P-GN-S  [CONN-TH_DB125-2.54-2P-GN]  73.5 50 180 top
U16  DB125-2.54-4P-GN-S  [CONN-TH_DB125-2.54-4P-GN]  63 50 180 top
U17  DB125-2.54-2P-GN-S  [CONN-TH_DB125-2.54-2P-GN]  21.5 60.5 90 top
USB1  TYPE-C 16PIN 2MD(073)  [USB-C-SMD_TYPE-C-6PIN-2MD-073]  21.5 75.5 270 top

## Footprints (pads in the part's own frame, mm; a bottom-side part is the same pattern mirrored in y, then rotated)
AMASS_XT90PW-F
  round 4.916 hole 3.9: N(-5.45,8.9)
  rect 4.916x4.916 hole 3.9: P(5.45,8.9)
  oval 1.3x2.6 hole 0.6x1.6: S1(9.45,0) S2(-9.45,0)
C1206
  rect 1.485x1.728 smd: 1(-1.593,0) 2(1.593,0)
CONN-TH_2P-P5.00_DB166-5.0-2P-GN-P
  round 2 hole 1.5: 1(-2.5,0) 2(2.5,0)
CONN-TH_DB125-2.54-2P-GN
  rect 1.8x1.8 hole 1.1: 1(-1.27,0)
  round 1.8 hole 1.1: 2(1.27,0)
CONN-TH_DB125-2.54-4P-GN
  rect 1.8x1.8 hole 1.1: 1(-3.81,0)
  round 1.8 hole 1.1: 2(-1.27,0) 3(1.27,0) 4(3.81,0)
CONN-TH_DB125-2.54-12P-GN
  rect 1.8x1.8 hole 1.1: 1(-13.97,0)
  round 1.8 hole 1.1: 2(-11.43,0) 3(-8.89,0) 4(-6.35,0) 5(-3.81,0) 6(-1.27,0) 7(1.27,0) 8(3.81,0) 9(6.35,0) 10(8.89,0) 11(11.43,0) 12(13.97,0)
F1206
  rect 1.19x1.728 smd: 1(-1.445,0) 2(1.445,0)
LED1206-R-RD_RED
  rect 1.485x1.62 smd: 1(1.492,0) 2(-1.492,0)
MSOP-10_L3.0-W3.0-P0.50-LS5.0-BL
  oval 0.28x1.62 smd: 1(-1,-2.11) 2(-0.5,-2.11) 3(0,-2.11) 4(0.5,-2.11) 5(1,-2.11) 6(1,2.11) 7(0.5,2.11) 8(0,2.11) 9(-0.5,2.11) 10(-1,2.11)
Pad_e132
  round 4 hole 3.51: 1(0,0)
Pad_e135
  round 4 hole 3.51: 1(0,0)
Pad_e136
  round 4 hole 3.51: 1(0,0)
Pad_e137
  round 4 hole 3.51: 1(0,0)
QFN-28_L5.0-W5.0-P0.50-TL-EP3.3
  rect 0.905x0.28 smd: 1(-2.377,1.5) 2(-2.377,1) 3(-2.377,0.5) 4(-2.377,0) 5(-2.377,-0.5) 6(-2.377,-1) 7(-2.377,-1.5) 15(2.377,-1.5) 16(2.377,-1) 17(2.377,-0.5) 18(2.377,0) 19(2.377,0.5) 20(2.377,1) 21(2.377,1.5)
  rect 0.28x0.905 smd: 8(-1.5,-2.377) 9(-1,-2.377) 10(-0.5,-2.377) 11(0,-2.377) 12(0.5,-2.377) 13(1,-2.377) 14(1.5,-2.377) 22(1.5,2.377) 23(1,2.377) 24(0.5,2.377) 25(0,2.377) 26(-0.5,2.377) 27(-1,2.377) 28(-1.5,2.377)
  rect 3.35x3.35 smd: 29(0,0)
R1206
  rect 1.208x1.701 smd: 1(-1.479,0) 2(1.479,0)
sensor-th_acs770lcb-100u-pff-t
  round 1.524 hole 0.914: 1(-1.91,-10.7) 2(0,-10.7) 3(1.91,-10.7)
  oval 8.6x4 hole 6x1.8: 4(4.826,10.7) 5(-4.826,10.7)
SENSOR-TH_ACS770LCB-100U-PFF-T
  round 1.524 hole 0.914: 1(-1.91,-10.7) 2(0,-10.7) 3(1.91,-10.7)
  oval 8.6x4 hole 6x1.8: 4(4.826,10.7) 5(-4.826,10.7)
SOT-23-3_L2.9-W1.6-P1.90-LS2.8-BR
  rect 1.07x0.6 smd: 1(1.235,-0.95) 2(1.235,0.95) 3(-1.235,0)
SOT-23-6_L2.9-W1.6-P0.95-LS2.8-BR
  rect 1.1x0.6 smd: 1(1.35,-0.95) 2(1.35,0) 3(1.35,0.95) 4(-1.35,0.95) 5(-1.35,0) 6(-1.35,-0.95)
SW-SMD_4P-L5.1-W5.1-P3.70-LS6.5-TL-2
  rect 1.7x1 smd: 1(-3.3,1.85) 2(3.3,1.85) 3(-3.3,-1.85) 4(3.3,-1.85)
TO-252-3_L6.5-W6.1-P4.58-LS9.9-BR
  rect 2.3x1.4 smd: 1(3.128,-2.29) 3(3.128,2.29)
  rect 6.2x5.8 smd: 2(-3.128,-0.004)
USB-C-SMD_TYPE-C-6PIN-2MD-073
  rect 0.55x1.1 smd: 1(-3.2,2.375) 2(-2.4,2.375) 11(2.4,2.375) 12(3.2,2.375)
  rect 0.3x1.1 smd: 3(-1.75,2.375) 4(-1.25,2.375) 5(-0.75,2.375) 6(-0.25,2.375) 7(0.25,2.375) 8(0.75,2.375) 9(1.25,2.375) 10(1.75,2.375)
  oval 1.1x2 hole 0.6x1.5: 13(-4.325,1.825) 14(4.325,1.825)
  oval 1.2x1.8 hole 0.6x1.2: 13(-4.325,-2.375) 14(4.325,-2.375)
WIFI-SMD_ESP32-WROVER-E
  rect 2x0.9 smd: 1(-9,11.43) 2(-9,10.16) 3(-9,8.89) 4(-9,7.62) 5(-9,6.35) 6(-9,5.08) 7(-9,3.81) 8(-9,2.54) 9(-9,1.27) 10(-9,0) 11(-9,-1.27) 12(-9,-2.54) 13(-9,-3.81) 14(-9,-5.08) 15(-9,-6.35) 16(-9,-7.62) 17(-9,-8.89) 18(-9,-10.16) 19(-9,-11.43) 20(9,-11.43) 21(9,-10.16) 22(9,-8.89) 23(9,-7.62) 24(9,-6.35) 25(9,-5.08) 26(9,-3.81) 27(9,-2.54) 28(9,-1.27) 29(9,0) 30(9,1.27) 31(9,2.54) 32(9,3.81) 33(9,5.08) 34(9,6.35) 35(9,7.62) 36(9,8.89) 37(9,10.16) 38(9,11.43)
  rect 1.33x1.33 smd: 39(-1,3.93) 40(-2.835,3.93) 41(0.835,3.93) 42(-2.835,5.765) 43(-1,5.765) 44(0.835,5.765) 45(-2.835,2.095) 46(-1,2.095) 47(0.835,2.095)

## Nets
As in the schematic.

Pads without a net: J1 S1 S2; J2 S1 S2; NOREF 1; NOREF#2 1; NOREF#3 1; NOREF#4 1; SW1 2 3; TV1 1 6; U2 4 5 6 7 8 17 18 19 20 21 22 24 27 28 29 32 40 41 42 43 44 45 46 47; U4 1 2 10 11 12 13 14 15 16 17 18 20 21 22 23 24 27 28 29; U6 2 4 5; USB1 3 9

## Via types
v1: diameter 0.6, hole 0.4, Top Layer to Bottom Layer, 32 vias
v2: diameter 1, hole 0.7, Top Layer to Bottom Layer, 9 vias

## Routing (per net, layer and track width the routed paths; a pad name or vN(x,y) marks a point on that pad's centre or on a via; arc(x,y) is an arc through that point)
+3.3V: length 172.1
  Top Layer w0.3: U4.6 U4.7 38.63,74.14 v1(38,73.5) ; U6.8 C8.2
  Top Layer w0.5: v1(83,73.75) 83.1,73.75 U10.4 ; v2(35,63) R10.1 ; v2(31.75,55) 31.75,57.84 C3.2 31.5,58.09 31.5,59.5 30.95,60.05 U1.2
  Top Layer w0.6: v2(52.25,29.75) 53.09,28.91 C8.2 ; R1.2 48,65 v2(47.5,64.5) ; U2.2 54.34,76.66 54,77 52.66,77 C1.2 C2.2 49.34,77 v1(47.5,77) ; R5.1 42,64.5 v2(43.5,63) 43.5,61.23 R11.1
  Bottom Layer w0.6: 49.38,66.38 51.5,68.5 77.75,68.5 v1(83,73.75) ; 49.38,66.38 47.5,68.25 v1(47.5,77) ; 49.38,66.38 v2(47.5,64.5) 46,63 45.75,63 ; 35,59.41 38,62.41 v1(38,73.5) ; 35,59.41 v2(35,63) ; 35,59.41 35,58.25 v2(31.75,55) 38,55 39,56 ; 45.75,63 45.75,62.75 39,56 ; 45.75,63 v2(43.5,63) ; 39,56 51,44 51,31 v2(52.25,29.75)
GND: length 53.8
  Top Layer w0.3: 63.03,27 63.02,26.99 61.53,26.99 ; USB1.13 USB1.13 USB1.14 USB1.14 ; v1(38,76.5) 38.37,76.14 U4.3 ; v1(70,70.43) 70,70.5 ; v1(32,78.5) R13.2
  Top Layer w0.5: USB1.1 23.88,79.28 USB1.13 ; USB1.12 23.88,71.72 USB1.14 ; TV1.2 v1(34,78) ; U2.38 86.54,77.93 U10.1
  Top Layer w1: U7.2 C11.2 ; U5.2 C9.2
  Bottom Layer w0.3: v1(66,70.43) v1(70,70.43) ; v1(34,78) 33.5,78.5 v1(32,78.5)
VBUS: length 130
  Top Layer w0.3: TV1.5 34,73 v1(34.5,72.5)
  Top Layer w0.6: 23.74,67.74 23.74,66.26 v2(25.5,64.5) ; 23.74,67.74 26,70 ; 23.74,67.74 21.5,65.5 U17.2 ; v1(25.75,79) 24.65,77.9 USB1.2 ; 26,70 26,71.82 24.72,73.1 USB1.11 ; 26,70 26.5,69.5 F1.1 ; v2(25.75,68) 25.25,68.5 25.25,69.25 ; R6.1 v2(34,69.5)
  Top Layer w1: U5.1 49.79,13.5 C7.2 ; U7.1 49.79,38 C10.2
  Bottom Layer w0.6: 45.5,35.89 45.5,16 46.91,14.59 U5.1 ; 45.5,35.89 45.5,37.5 26,57 26,64 v2(25.5,64.5) ; 45.5,35.89 U7.1 ; 32.5,68 v2(25.75,68) 25.25,68.5 25.25,78.5 v1(25.75,79) ; 32.5,68 32.5,70.5 v1(34.5,72.5) ; 32.5,68 v2(34,69.5)
BOOT0: length 17.2
  Top Layer w0.5: U11.1 76.5,50 80,53.5 80,59 77.58,61.42 U2.25
GPIO4: length 15.1
  Top Layer w0.5: U2.26 78.92,62.69 U10.10
GPIO18: length 16.8
  Top Layer w0.5: U10.9 86.2,57.95 86.2,59.05 77.48,67.77 U2.30
GPIO19: length 16
  Top Layer w0.5: U2.31 78.35,69.04 87.5,59.89 U10.8
GPIO23: length 12.4
  Top Layer w0.5: U2.37 85.27,76.66 U10.2
GPIO25: length 43.2
  Top Layer w0.5: v1(82.5,57) 82.5,56.57 U10.11 ; U2.10 57.72,66.22 v1(56.43,66.22)
  Bottom Layer w0.5: v1(82.5,57) 82.5,64 80.28,66.22 v1(56.43,66.22)
GPIO26: length 43.6
  Top Layer w0.5: v1(81,56) 81,55.53 U10.12 ; U2.11 56.96,65.23 v1(56.5,64.78)
  Bottom Layer w0.5: v1(56.5,64.78) 79.22,64.78 81,63 v1(81,56)
GPIO27: length 41.6
  Top Layer w0.5: R15.2 66.5,34.25 ; 66.5,34.25 67.25,35 70.08,35 U8.1 ; 66.5,34.25 66.5,35.5 v1(66.25,35.75) ; U2.12 56.94,63.96 v1(56.5,63.53)
  Bottom Layer w0.5: v1(66.25,35.75) 65,35.75 55.5,45.25 55.5,62.53 v1(56.5,63.53)
GPIO33: length 58.5
  Top Layer w0.5: U2.9 56.92,67.77 v1(56.47,67.33) ; 67,22.25 67.25,22.5 67.25,24.75 v1(66.75,25.25) ; 67,22.25 66.5,21.75 R14.2 ; 67,22.25 70.08,22.25 U9.1
  Bottom Layer w0.5: v1(66.75,25.25) 53.75,38.25 53.75,64.6 v1(56.47,67.33)
RXD0: length 60.2
  Top Layer w0.3: U4.26 40.97,79.22 v1(41.75,80)
  Top Layer w0.5: v1(80.25,72.75) 80.15,72.85 78.92,72.85 ; 78.92,72.85 U2.34 ; 78.92,72.85 U10.6
  Bottom Layer w0.3: v1(41.75,80) 43.75,78 55.5,78 60.5,73 80,73 v1(80.25,72.75)
SCL: length 87.7
  Top Layer w0.3: v1(54.25,24.25) 56,26 U6.10
  Top Layer w0.5: U10.3 84,75.39 U2.36
  Bottom Layer w0.3: v1(54.25,24.25) 68.75,24.25 72,27.5 72,39.5 84,51.5 84,70 85.89,71.89 U10.3
SDA: length 85
  Top Layer w0.3: U6.9 55,26.5 v1(53.75,25.25)
  Top Layer w0.5: U2.33 77.65,71.58 U10.7
  Bottom Layer w0.3: v1(53.75,25.25) 52.75,24.25 52.75,23.5 53.25,23 69.5,23 73.5,27 73.5,39 85.5,51 85.5,59.73 U10.7
TCK: length 11.4
  Top Layer w0.5: v1(56.5,58.5) 56.88,58.88 U2.16
  Bottom Layer w0.5: U16.4 59.19,56.06 56.75,58.5 v1(56.5,58.5)
TDI: length 14.8
  Top Layer w0.5: U2.14 56.92,61.42 v1(56.5,61)
  Bottom Layer w0.5: v1(56.5,61) 61.73,55.77 U16.3
TDO: length 19.5
  Top Layer w0.5: U16.1 69.31,52.5 76.5,52.5 78,54 78,58.5 77.62,58.88 U2.23
TMS: length 17.7
  Top Layer w0.5: v1(56.5,62.25) 56.94,62.69 U2.13
  Bottom Layer w0.5: v1(56.5,62.25) 57.5,62.25 64.27,55.48 U16.2
TXD0: length 59.7
  Top Layer w0.3: v1(43.25,80.5) 43.25,80.4 41.47,78.61 U4.25
  Top Layer w0.5: U10.5 80.19,74.12 ; 80.19,74.12 U2.35 ; 80.19,74.12 80.57,74.5 v1(81,74.5)
  Bottom Layer w0.3: v1(43.25,80.5) 43.25,80 44.25,79 56,79 61,74 80.5,74 v1(81,74.5)
USB_D+: length 26.2
  Top Layer w0.3: 27,77 25.75,75.75 USB1.6 ; 27,77 32.9,77 TV1.3 33.05,78.55 33.75,79.25 35.25,79.25 37,77.5 37,76.5 37.87,75.64 U4.4 ; 27,77 v1(27,76) ; USB1.8 25.25,74.75 v1(26.25,73.75)
  Bottom Layer w0.3: v1(27,76) 26.25,75.25 v1(26.25,73.75)
USB_D-: length 25.1
  Top Layer w0.3: U4.5 37.63,75.14 37,74.5 37,73.5 35.25,71.75 33.75,71.75 33.05,72.45 TV1.4 26.85,74.15 25.75,75.25 USB1.7 23.83,75.2 21.8,75.2 21.5,75.5 21.5,76 21.75,76.25 USB1.5
$1N2: length 13
  Top Layer w0.6: 46.18,62.82 45,64 C6.2 ; 46.18,62.82 48.82,62.82 51,65 R4.1 ; 46.18,62.82 46.7,62.3 SW1.4
$1N3: length 14.9
  Top Layer w0.75: U2.3 56.62,75.39 56,74.77 56,72 55.5,71.5 54.5,71.5 54,71 C5.2
  Top Layer w1: R1.1 R4.2 53.89,69.48 C5.2
$1N21: length 6.6
  Top Layer w0.5: U1.3 30,64.5 30.5,65 30.5,66.41 C4.2
  Top Layer w1: F1.2 30.44,66.65 C4.2
$1N27: length 2.8
  Top Layer w1: R11.2 43.74,58.01 LED3.1
$1N28: length 18
  Top Layer w0.3: U4.19 v1(45,76.14)
  Top Layer w0.6: v2(41,63) LED3.2
  Bottom Layer w0.6: v1(45,76.14) 41,72.14 v2(41,63)
$1N32: length 7.2
  Top Layer w0.3: R6.2 38.98,70.98 39.97,71.97 U4.8
  Top Layer w1: R6.2 R7.1
$1N37: length 4.4
  Top Layer w0.3: R5.2 42,70.5 40.47,72.03 U4.9
$1N45: length 20.8
  Top Layer w0.3: U6.6 56.25,28 55.5,28.75 55.5,31 59.5,35 59.5,39.75 58.25,41 C11.1 56.98,41.11 R9.2
$1N46: length 5.8
  Top Layer w1: U7.3 49.79,44 R9.1
$1N48: length 29.1
  Top Layer w0.3: R8.2 57.09,19.39 C9.1 v1(59.5,16.5) ; U6.7 55,27.5 54.5,28 v1(54.5,28.5)
  Bottom Layer w0.3: v1(59.5,16.5) 59.5,21 58.5,22 52.5,22 51.5,23 51.5,24.5 54.5,27.5 v1(54.5,28.5)
$1N49: length 5.8
  Top Layer w1: R8.1 49.79,19.5 U5.3
$1N11253: length 3
  Top Layer w1: LED2.1 37.99,58.02 R10.2
$1N11937: length 4.2
  Top Layer w0.3: USB1.10 25.25,73.75 26.5,72.5 R12.1
$1N11979: length 4.4
  Top Layer w0.3: R13.1 26.5,78.5 24.75,76.75 USB1.4

## Copper pours and planes (outline as drawn; the poured copper is in the pictures)
GND on Top Layer: 91.81,86.08 17.81,86.08 17.81,58.33 0.31,58.33 0.31,0.08 91.81,0.08
GND on Bottom Layer: 91.4,85.95 17.4,85.95 17.4,58.2 -0.1,58.2 -0.1,-0.05 91.4,-0.05
EXTOUTPUTV1 on Top Layer: 76,34.75 88,34.75 88,30.75 76,30.75
EXTOUTPUTV2 on Top Layer: 76,22 88,22 88,18 76,18
IP2+ on Top Layer: 9.5,50.5 29.5,50.5 29.5,41.5 9.5,41.5
IP2+ on Bottom Layer: 9.5,50.5 29.5,50.5 29.5,41.5 9.5,41.5
IP2- on Top Layer: 9.5,40.5 29.5,40.5 29.5,31.5 9.5,31.5
IP2- on Bottom Layer: 9.5,40.5 29.5,40.5 29.5,31.5 9.5,31.5
IP+ on Top Layer: 9.5,26 29.5,26 29.5,17 9.5,17
IP+ on Bottom Layer: 9.5,26 29.5,26 29.5,17 9.5,17
IP- on Top Layer: 9.5,16 29.5,16 29.5,7 9.5,7
IP- on Bottom Layer: 9.5,16 29.5,16 29.5,7 9.5,7

## Text on the board
Top Silkscreen Layer: SDA-> | SCL-> | GPIO33-> | GPIO27-> | POWER | DATA | +5V | GND | GPIO23 | GPIO25 | GPIO26 | GPIO19 | GPIO18 | +3.3V | GPIO4 | V+ | SCL | TXD | RXD | SDA | BOOT | TMS | TDI | TCK | TDO | EN | CURRENT | SENSING | RELAY | CONTROL | RUTGERS IGVC | E-STOP & CURRENT | REV 1 | I- | I+
